# EAGLE schematic Dashboard 2019 I2C (EAGLE 9.1.3)
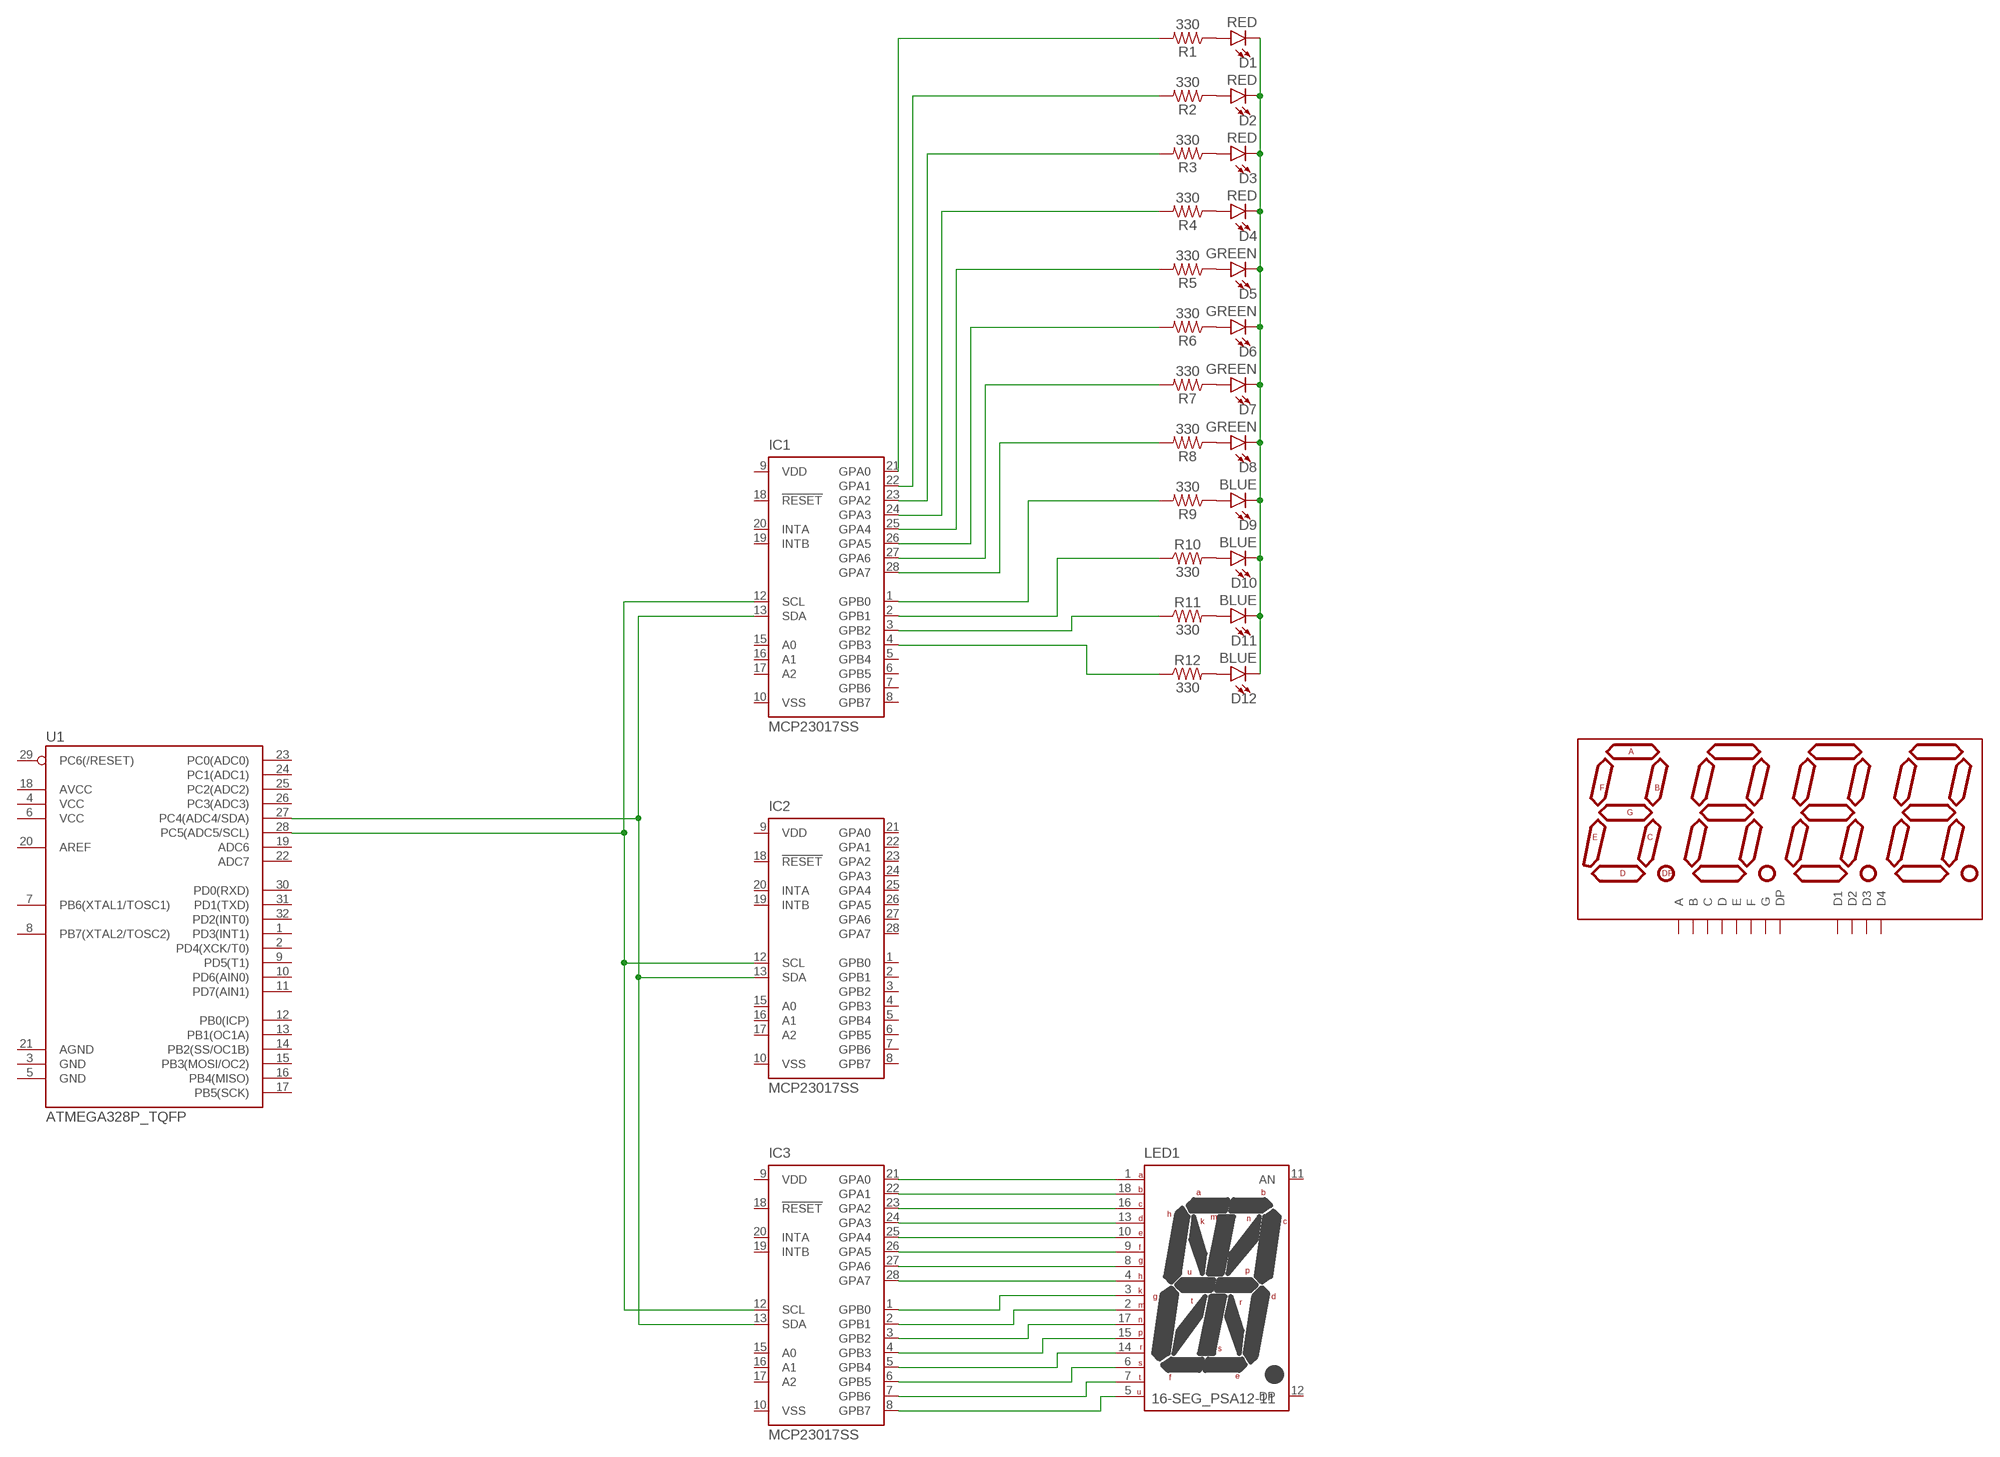
[diagram p0: schematic, sheet 1]

## Parts
D1  RED  LED-RED1206  [LED-1206]
D2  RED  LED-RED1206  [LED-1206]
D3  RED  LED-RED1206  [LED-1206]
D4  RED  LED-RED1206  [LED-1206]
D5  GREEN  LED-GREENLILYPAD  [LED-1206]
D6  GREEN  LED-GREENLILYPAD  [LED-1206]
D7  GREEN  LED-GREENLILYPAD  [LED-1206]
D8  GREEN  LED-GREENLILYPAD  [LED-1206]
D9  BLUE  LED-BLUE1206  [LED-1206]
D10  BLUE  LED-BLUE1206  [LED-1206]
D11  BLUE  LED-BLUE1206  [LED-1206]
D12  BLUE  LED-BLUE1206  [LED-1206]
DISP1  ATA8041ARBJ  7-SEGMENT-4DIGIT-20MM-RED  [7-SEGMENT-4DIGIT-20MM]
IC1  MCP23017SS  [SSOP28]
IC2  MCP23017SS  [SSOP28]
IC3  MCP23017SS  [SSOP28]
LED1  16-SEG_PSA12-11  [PSA12-11]
R1  330  330OHM-0603-1/10W-1%  [0603]
R2  330  330OHM-0603-1/10W-1%  [0603]
R3  330  330OHM-0603-1/10W-1%  [0603]
R4  330  330OHM-0603-1/10W-1%  [0603]
R5  330  330OHM-0603-1/10W-1%  [0603]
R6  330  330OHM-0603-1/10W-1%  [0603]
R7  330  330OHM-0603-1/10W-1%  [0603]
R8  330  330OHM-0603-1/10W-1%  [0603]
R9  330  330OHM-0603-1/10W-1%  [0603]
R10  330  330OHM-0603-1/10W-1%  [0603]
R11  330  330OHM-0603-1/10W-1%  [0603]
R12  330  330OHM-0603-1/10W-1%  [0603]
U1  ATMEGA328P_TQFP  [TQFP32-08]

## Nets
N$1: IC1.12(SCL) IC2.12(SCL) IC3.12(SCL) U1.28(PC5(ADC5/SCL))
N$2: IC1.13(SDA) IC2.13(SDA) IC3.13(SDA) U1.27(PC4(ADC4/SDA))
N$3: D1.A R1.1
N$4: D2.A R2.1
N$5: D3.A R3.1
N$6: D4.A R4.1
N$7: D5.A R5.1
N$8: D6.A R6.1
N$9: D7.A R7.1
N$10: D8.A R8.1
N$11: D9.A R9.1
N$12: D10.A R10.2
N$13: D11.A R11.2
N$14: D12.A R12.2
N$15: IC1.21(GPA0) R1.2
N$16: D1.C D2.C D3.C D4.C D5.C D6.C D7.C D8.C D9.C D10.C D11.C D12.C
N$17: IC1.22(GPA1) R2.2
N$18: IC1.23(GPA2) R3.2
N$19: IC1.24(GPA3) R4.2
N$20: IC1.25(GPA4) R5.2
N$21: IC1.26(GPA5) R6.2
N$22: IC1.27(GPA6) R7.2
N$23: IC1.28(GPA7) R8.2
N$24: IC1.1(GPB0) R9.2
N$25: IC1.2(GPB1) R10.1
N$26: IC1.3(GPB2) R11.1
N$27: IC1.4(GPB3) R12.1
N$28: IC3.21(GPA0) LED1.1(A)
N$29: IC3.22(GPA1) LED1.18(B)
N$30: IC3.23(GPA2) LED1.16(C)
N$31: IC3.24(GPA3) LED1.13(D)
N$32: IC3.25(GPA4) LED1.10(E)
N$33: IC3.26(GPA5) LED1.9(F)
N$34: IC3.27(GPA6) LED1.8(G)
N$35: IC3.28(GPA7) LED1.4(H)
N$36: IC3.1(GPB0) LED1.3(K)
N$37: IC3.2(GPB1) LED1.2(M)
N$38: IC3.3(GPB2) LED1.17(N)
N$39: IC3.4(GPB3) LED1.15(P)
N$40: IC3.5(GPB4) LED1.14(R)
N$41: IC3.6(GPB5) LED1.6(S)
N$42: IC3.7(GPB6) LED1.7(T)
N$43: IC3.8(GPB7) LED1.5(U)
Unconnected: DISP1.1(E) DISP1.2(D) DISP1.3(DP) DISP1.4(C) DISP1.5(G) DISP1.6(D4) DISP1.7(B) DISP1.8(D3) DISP1.9(D2) DISP1.10(F) DISP1.11(A) DISP1.12(D1) IC1.5(GPB4) IC1.6(GPB5) IC1.7(GPB6) IC1.8(GPB7) IC1.15(A0) IC1.16(A1) IC1.17(A2) IC1.18(!RESET) IC1.19(INTB) IC1.20(INTA) IC2.1(GPB0) IC2.2(GPB1) IC2.3(GPB2) IC2.4(GPB3) IC2.5(GPB4) IC2.6(GPB5) IC2.7(GPB6) IC2.8(GPB7) IC2.15(A0) IC2.16(A1) IC2.17(A2) IC2.18(!RESET) IC2.19(INTB) IC2.20(INTA) IC2.21(GPA0) IC2.22(GPA1) IC2.23(GPA2) IC2.24(GPA3) IC2.25(GPA4) IC2.26(GPA5) IC2.27(GPA6) IC2.28(GPA7) IC3.15(A0) IC3.16(A1) IC3.17(A2) IC3.18(!RESET) IC3.19(INTB) IC3.20(INTA) LED1.11(AN) LED1.12(DP) U1.1(PD3(INT1)) U1.2(PD4(XCK/T0)) U1.3(GND) U1.4(VCC) U1.5(GND) U1.6(VCC) U1.7(PB6(XTAL1/TOSC1)) U1.8(PB7(XTAL2/TOSC2)) U1.9(PD5(T1)) U1.10(PD6(AIN0)) U1.11(PD7(AIN1)) U1.12(PB0(ICP)) U1.13(PB1(OC1A)) U1.14(PB2(SS/OC1B)) U1.15(PB3(MOSI/OC2)) U1.16(PB4(MISO)) U1.17(PB5(SCK)) U1.18(AVCC) U1.19(ADC6) U1.20(AREF) U1.21(AGND) U1.22(ADC7) U1.23(PC0(ADC0)) U1.24(PC1(ADC1)) U1.25(PC2(ADC2)) U1.26(PC3(ADC3)) U1.29(PC6(/RESET)) U1.30(PD0(RXD)) U1.31(PD1(TXD)) U1.32(PD2(INT0))

## Power pins joined to a net without a drawn wire
VDD: IC1.9(VDD) IC2.9(VDD) IC3.9(VDD)
VSS: IC1.10(VSS) IC2.10(VSS) IC3.10(VSS)

## Library data of the parts
D1-D4 = SparkFun-LED:LED-RED: Red SMD LED Used in manufacturing of most products at SparkFun Packages: 0603 - SMD 0603 package [Product Link] <http://docs.avagotech.com/docs/AV02-0551EN> 0603 SMART - SMD 0603 SMART package ( more efficient and expensive)[Product Link] <http://www.osram-os.com/Graphics/XPic2/00077099_0.pdf> 1206 - SMD1206 package [Product Link] <https://www.sparkfun.com/datasheets/DevTools/LilyPad/Q150OVS4.pdff> SparkFun Products: Pro Mini 328 -5V <https://www.sparkfun.com/products/821> RedBoard <https://www.sparkfun.com/products/12757> IOIO-OTG <https://www.sparkfun.com/products/13613>; PROD_ID: DIO-09912
D5-D8 = SparkFun-LED:LED-GREEN: Green SMD LED Used in manufacturing of various products at SparkFun Packages: 0603 - SMD 0603 package [Product Link] <http://www.futureelectronics.com/en/technologies/semiconductors/optoelectronics/leds/Pages/9894312-LTST-C190GKT.aspx?CrossPart=HSMG-C190&IM=0> LilyPad 1206 - SMD1206 LilyPad package [Product Link] <http://www.futureelectronics.com/en/Technologies/Product.aspx?ProductID=IN150NGHARVATEKCORPORATION2049943&IM=0> 1206 - SMD1206 package [Product Link] <http://www.futureelectronics.com/en/technologies/semiconductors/optoelectronics/leds/Pages/8315665-LTST-C150KGKT.aspx?IM=0> 1206 Bottom Mount -SMD 1206 Bottom Mount [Product Link] <http://www.digikey.com/product-detail/en/lite-on-inc/LTST-C230KGKT/160-1456-1-ND/386854> SparkFun Products: Pro Mini 328 -5V <https://www.sparkfun.com/products/821> RedBoard <https://www.sparkfun.com/products/12757> MP3 Trigger <https://www.sparkfun.com/products/13720> Makey Makey <https://www.sparkfun.com/products/11076>; PROD_ID: DIO-09910
D9-D12 = SparkFun-LED:LED-BLUE: Blue SMD LED Used in manufacturing of various products at SparkFun Packages: 0603 - SMD 0603 package [Product Link] <http://www.digikey.com/product-detail/en/SMLE12BC7TT86/511-1589-2-ND/1641808> 1206 - SMD1206 package [Product Link] <http://www.digikey.com/product-detail/en/lite-on-inc/LTST-C150TBKT/160-1643-1-ND/573584> SparkFun Products: ESP8266 Thing-Dev Board <https://www.sparkfun.com/products/13711> RedBoard <https://www.sparkfun.com/products/12757>; PROD_ID: DIO-09911
DISP1 = SparkFun-LED:7-SEGMENT-4DIGIT-20MM: 4 Digit 7 Segment Display This is a part for the 4-Digit 7-segment LEDs from Young Sun. Different from the Digikey LEDs, all 16 pins are used. The LONGPADS Variant is used for a test jig, but you may like it because there is more pad to solder to. If you are concerned about routing space, the standard works just fine though. Datasheets: Red <http://cdn.sparkfun.com/datasheets/Components/LED/1LEDREDCC.pdf> Yellow <http://cdn.sparkfun.com/datasheets/Components/LED/1LEDYELCC.pdf> Green <http://cdn.sparkfun.com/datasheets/Components/LED/1LEDGRNCC.pdf> Blue <http://cdn.sparkfun.com/datasheets/Components/LED/1LEDBLUCC.pdf> White <http://cdn.sparkfun.com/datasheets/Components/LED/1LEDWHTCC.pdf> SparkFun Products Raw Components 7-Segment Display - 20mm (Red) <https://www.sparkfun.com/products/11405> (COM-11405) 7-Segment Display - 20mm (Yellow) <https://www.sparkfun.com/products/11406> (COM-11406) 7-Segment Display - 20mm (Green) <https://www.sparkfun.com/products/11407> (COM-11407) 7-Segment Display - 20mm (Blue) <https://www.sparkfun.com/products/11408> (COM-11408) 7-Segment Display - 20mm (White) <https://www.sparkfun.com/products/11409> (COM-11409) Serial Controlled SparkFun OpenSegment Serial Display - 20mm (Red) <https://www.sparkfun.com/products/11644> (COM-11644) SparkFun OpenSegment Serial Display - 20mm (Yellow) <https://www.sparkfun.com/products/11645> (COM-11645) SparkFun OpenSegment Serial Display - 20mm (Green) <https://www.sparkfun.com/products/11646> (COM-11646) SparkFun OpenSegment Serial Display - 20mm (Blue) <https://www.sparkfun.com/products/11647> (COM-11647) SparkFun OpenSegment Serial Display - 20mm (White) <https://www.sparkfun.com/products/11648> (COM-11648) Other SparkFun OpenSegment Shield <https://www.sparkfun.com/products/13190> (DEV-13190); PROD_ID: COMP-11449
IC1-IC3 = microchip:MCP23017: http://ww1.microchip.com/downloads/en/DeviceDoc/21952a.pdf Source: http://ww1.microchip.com/downloads/en/DeviceDoc/21952a.pdf; MF: MICROCHIP; MPN: MCP23017-E/SS; OC_FARNELL: 1467674; OC_NEWARK: 31K2960
LED1 = display-kingbright:16-SEG_: 16 SEGMENT SINGLE DIGIT ALPHANUMERIC NUMERIC DISPLAY; OC_FARNELL: unknown; OC_NEWARK: unknown
R1-R12 = SparkFun-Resistors:330OHM: 330Ω resistor A resistor is a passive two-terminal electrical component that implements electrical resistance as a circuit element. Resistors act to reduce current flow, and, at the same time, act to lower voltage levels within circuits. - Wikipedia; PROD_ID: RES-00818
U1 = SparkFun-IC-Microcontroller:ATMEGA328P_TQFP: Popular 328P in QFP Storefront component: ATmega328 - TQFP <https://www.sparkfun.com/products/13448> (COM-13448) Datasheet <http://www.sparkfun.com/datasheets/Components/SMD/ATMega328.pdf> SparkFun Products SparkFun RedBoard - Programmed with Arduino <https://www.sparkfun.com/products/12757> (DEV-12757) Arduino Pro Mini 328 - 5V/16MHz <https://www.sparkfun.com/products/11113> (DEV-11113) Arduino Pro Mini 328 - 3.3V/8MHz <https://www.sparkfun.com/products/11114> (DEV-11114) SparkFun OpenLog <https://www.sparkfun.com/products/13712> (DEV-13712) SparkFun MicroView - OLED Arduino Module <https://www.sparkfun.com/products/12923> (DEV-12923) SparkFun Digital Sandbox <https://www.sparkfun.com/products/12651> (DEV-12651) SparkFun PicoBoard <https://www.sparkfun.com/products/11888> (WIG-11888) Arduino Fio <https://www.sparkfun.com/products/10116> (DEV-10116) LilyPad Arduino 328 Main Board <https://www.sparkfun.com/products/13342> (DEV-13342) SparkFun RedStick <https://www.sparkfun.com/products/13741> (DEV-13741) LilyPad MP3 <https://www.sparkfun.com/products/11013> (DEV-11013) LilyPad Arduino SimpleSnap <https://www.sparkfun.com/products/10941> (DEV-10941) SparkFun Stepoko <https://www.sparkfun.com/products/13899> (ROB-13899) SparkFun Geiger Counter <https://www.sparkfun.com/products/11345> (SEN-11345) SparkFun EL Sequencer <https://www.sparkfun.com/products/12781> (COM-12781) Arduino Pro 328 - 5V/16MHz <https://www.sparkfun.com/products/10915> (DEV-10915) CryptoCape <https://www.sparkfun.com/products/12773> (DEV-12773) SparkFun IR Thermometer Evaluation Board - MLX90614 <https://www.sparkfun.com/products/10740> (SEN-10740) SparkFun RedBot Mainboard <https://www.sparkfun.com/products/12097> (ROB-12097) Arduino Pro 328 - 3.3V/8MHz <https://www.sparkfun.com/products/10914> (DEV-10914) SparkFun Block for Intel® Edison - Arduino <https://www.sparkfun.com/products/13036> (DEV-13036) SparkFun Simon Says - Surface Mount Soldering Kit <https://www.sparkfun.com/products/10935> (KIT-10935) SparkFun 7-Segment Serial Display - Red <https://www.sparkfun.com/products/11441> (COM-11441) SparkFun 7-Segment Serial Display - White <https://www.sparkfun.com/products/11629> (COM-11629) SparkFun 7-Segment Serial Display - Yellow <https://www.sparkfun.com/products/11443> (COM-11443) SparkFun 7-Segment Serial Display - Kelly Green <https://www.sparkfun.com/products/11440> (COM-11440) SparkFun 7-Segment Serial Display - Blue <https://www.sparkfun.com/products/11442> (COM-11442) SparkFun OpenSegment Serial Display - 20mm (Blue) <https://www.sparkfun.com/products/11647> (COM-11647) SparkFun OpenSegment Serial Display - 20mm (Green) <https://www.sparkfun.com/products/11646> (COM-11646) SparkFun OpenSegment Serial Display - 20mm (White) <https://www.sparkfun.com/products/11648> (COM-11648) SparkFun OpenSegment Serial Display - 20mm (Red) <https://www.sparkfun.com/products/11644> (COM-11644) SparkFun OpenSegment Serial Display - 20mm (Yellow) <https://www.sparkfun.com/products/11645> (COM-11645) SparkFun OpenSegment Shield <https://www.sparkfun.com/products/13190> (DEV-13190); PROD_ID: IC-09069